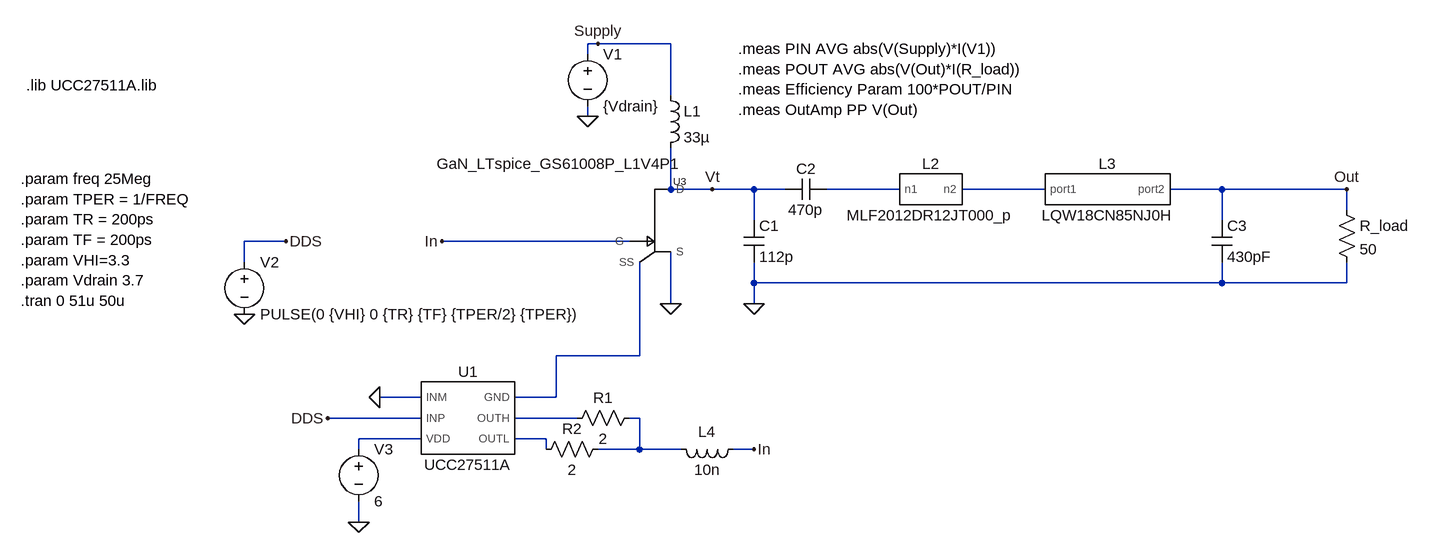
[diagram p0: schematic Class_E+Driver2.asc]
Class_E+Driver2.asc, the LTspice schematic file:
Version 4.1
SHEET 1 1288 800
WIRE 32 -96 16 -96
WIRE 144 -96 32 -96
WIRE 16 -80 16 -96
WIRE 144 -16 144 -96
WIRE 16 16 16 0
WIRE 144 128 144 64
WIRE 208 128 144 128
WIRE 272 128 208 128
WIRE 320 128 272 128
WIRE 496 128 384 128
WIRE 720 128 592 128
WIRE 992 128 912 128
WIRE 1184 128 992 128
WIRE 1184 160 1184 128
WIRE 272 176 272 128
WIRE 992 176 992 128
WIRE -448 208 -512 208
WIRE 80 208 -208 208
WIRE -512 240 -512 208
WIRE 272 272 272 240
WIRE 992 272 992 240
WIRE 992 272 272 272
WIRE 1184 272 1184 240
WIRE 1184 272 992 272
WIRE 144 304 144 224
WIRE 272 304 272 272
WIRE 96 384 96 240
WIRE 96 384 -32 384
WIRE -240 448 -304 448
WIRE -32 448 -32 384
WIRE -32 448 -96 448
WIRE -240 480 -384 480
WIRE 0 480 -96 480
WIRE 96 480 80 480
WIRE -240 512 -336 512
WIRE -48 512 -96 512
WIRE -336 528 -336 512
WIRE -48 528 -48 512
WIRE 96 528 96 480
WIRE 96 528 32 528
WIRE 160 528 96 528
WIRE 272 528 240 528
WIRE -336 640 -336 608
FLAG 16 16 0
FLAG -512 320 0
FLAG 272 304 0
FLAG -208 208 In
FLAG 208 128 Vt
FLAG 32 -96 Supply
FLAG 144 304 0
FLAG 1184 128 Out
FLAG -448 208 DDS
FLAG -304 448 0
FLAG -384 480 DDS
FLAG 272 528 In
FLAG -336 640 0
SYMBOL voltage 16 -96 R0
WINDOW 123 0 0 Left 0
WINDOW 39 0 0 Left 0
SYMATTR InstName V1
SYMATTR Value {Vdrain}
SYMBOL voltage -512 224 R0
WINDOW 123 0 0 Left 0
WINDOW 39 0 0 Left 0
SYMATTR InstName V2
SYMATTR Value PULSE(0 {VHI} 0 {TR} {TF} {TPER/2} {TPER})
SYMBOL ind 128 -32 R0
SYMATTR InstName L1
SYMATTR Value 33µ
SYMATTR SpiceLine Ipk=0.46 Rser=0.4 Rpar=17706.6 Cpar=0 mfg="Coilcraft" pn="1812PS-333"
SYMBOL cap 384 112 R90
WINDOW 0 0 32 VBottom 2
WINDOW 3 32 32 VTop 2
SYMATTR InstName C2
SYMATTR Value 470p
SYMATTR SpiceLine V=50 Irms=2.20811 Rser=0.0430702 Lser=294.083p mfg="Vishay" pn="VJ0603D471KXXAJ" type="COG"
SYMBOL cap 256 176 R0
SYMATTR InstName C1
SYMATTR Value 112p
SYMATTR SpiceLine V=100 Irms=3 Rser=0.0782135 Lser=306.378p
SYMBOL cap 976 176 R0
SYMATTR InstName C3
SYMATTR Value 430pF
SYMBOL res 1168 144 R0
SYMATTR InstName R_load
SYMATTR Value 50
SYMBOL UCC27511A -176 480 R0
SYMATTR InstName U1
SYMBOL voltage -336 512 R0
WINDOW 123 0 0 Left 0
WINDOW 39 0 0 Left 0
SYMATTR InstName V3
SYMATTR Value 6
SYMBOL res 96 464 R90
WINDOW 0 0 56 VBottom 2
WINDOW 3 32 56 VTop 2
SYMATTR InstName R1
SYMATTR Value 2
SYMBOL res 48 512 R90
WINDOW 0 0 56 VBottom 2
WINDOW 3 32 56 VTop 2
SYMATTR InstName R2
SYMATTR Value 2
SYMBOL ind 256 512 R90
WINDOW 0 5 56 VBottom 2
WINDOW 3 32 56 VTop 2
SYMATTR InstName L4
SYMATTR Value 10n
SYMBOL GaN_LTspice_GS61008P_L1V4P1 96 176 R0
SYMATTR InstName U3
SYMBOL MLF2012DR12JT000_p 544 128 R0
SYMATTR InstName L2
SYMBOL LQW18CN85NJ0H 816 128 R0
SYMATTR InstName L3
TEXT -856 112 Left 2 !.param freq 25Meg\n.param TPER = 1/FREQ\n.param TR = 200ps\n.param TF = 200ps\n.param VHI=3.3\n.param Vdrain 3.7\n.tran 0 51u 50u
TEXT 248 -88 Left 2 !.meas PIN AVG abs(V(Supply)*I(V1))\n.meas POUT AVG abs(V(Out)*I(R_load))\n.meas Efficiency Param 100*POUT/PIN\n.meas OutAmp PP V(Out)
TEXT -848 -32 Left 2 !.lib UCC27511A.lib

The netlist it stands for:
* Class_E+Driver2.asc
V1 Supply 0 {Vdrain}
V2 DDS 0 PULSE(0 {VHI} 0 {TR} {TF} {TPER/2} {TPER})
L1 Supply Vt 33µ Ipk=0.46 Rser=0.4 Rpar=17706.6 Cpar=0 mfg="Coilcraft" pn="1812PS-333"
C2 N001 Vt 470p V=50 Irms=2.20811 Rser=0.0430702 Lser=294.083p mfg="Vishay" pn="VJ0603D471KXXAJ" type="COG"
C1 Vt 0 112p V=100 Irms=3 Rser=0.0782135 Lser=306.378p
C3 Out 0 430pF
R_load Out 0 50
X§U1 0 DDS N006 N003 N004 N007 UCC27511A  ; pins INM INP VDD GND OUTH OUTL
V3 N006 0 6
R1 N005 N004 2
R2 N005 N007 2
L4 In N005 10n
X§U3 In Vt 0 N003 GaN_LTspice_GS61008P_L1V4P1  ; pins G D S SS
X§L2 N001 N002 MLF2012DR12JT000_p  ; pins n1 n2
X§L3 N002 Out LQW18CN85NJ0H  ; pins port1 port2
.param freq 25Meg
.param TPER = 1/FREQ
.param TR = 200ps
.param TF = 200ps
.param VHI=3.3
.param Vdrain 3.7
.tran 0 51u 50u
.meas PIN AVG abs(V(Supply)*I(V1))
.meas POUT AVG abs(V(Out)*I(R_load))
.meas Efficiency Param 100*POUT/PIN
.meas OutAmp PP V(Out)
.lib UCC27511A.lib
.lib UCC27511A.lib
.lib GaN_LTspice_GS61008P_L1V4P1.lib
.lib C:\Users\lrwon\Downloads\mlf2012dr12jt000_p.mod
.lib C:\Users\lrwon\Documents\CEN4907C\Fall 2025\dtcp\LTspice\Amplifier\LQW18CN85NJ0H.mod
.backanno
.end